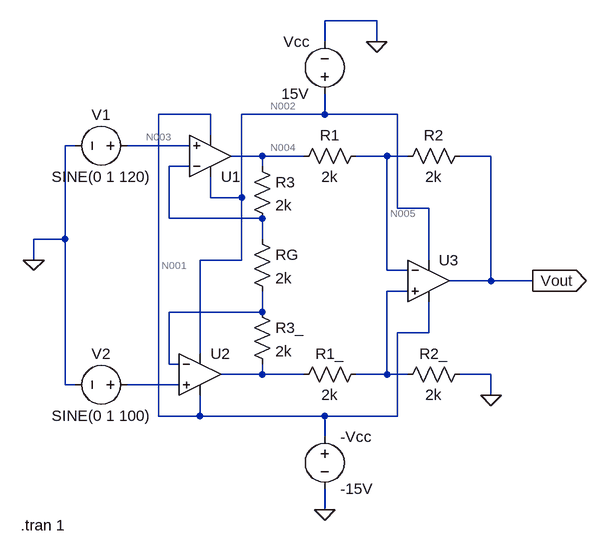
[diagram p0: schematic Q4.asc]
Q4.asc, the LTspice schematic file:
Version 4
SHEET 1 880 680
WIRE 320 -272 240 -272
WIRE 240 -240 240 -272
WIRE 320 -240 320 -272
WIRE 64 -128 -16 -128
WIRE 240 -128 240 -160
WIRE 240 -128 112 -128
WIRE 352 -128 240 -128
WIRE 64 -96 64 -128
WIRE -144 -80 -160 -80
WIRE 32 -80 -64 -80
WIRE 144 -64 96 -64
WIRE 208 -64 144 -64
WIRE 336 -64 288 -64
WIRE 368 -64 336 -64
WIRE 496 -64 448 -64
WIRE 32 -48 0 -48
WIRE 144 -48 144 -64
WIRE 64 0 64 -32
WIRE 112 0 112 -128
WIRE 112 0 64 0
WIRE 352 16 352 -128
WIRE 400 16 352 16
WIRE 0 32 0 -48
WIRE 144 32 0 32
WIRE -160 64 -160 -80
WIRE -160 64 -208 64
WIRE 144 64 144 32
WIRE -208 96 -208 64
WIRE 112 96 112 0
WIRE 112 96 48 96
WIRE 400 96 400 16
WIRE 336 112 336 -64
WIRE 368 112 336 112
WIRE 496 128 496 -64
WIRE 496 128 432 128
WIRE 560 128 496 128
WIRE 368 144 336 144
WIRE 144 176 144 144
WIRE 144 176 0 176
WIRE 400 208 400 160
WIRE 400 208 352 208
WIRE 48 240 48 96
WIRE 0 256 0 176
WIRE 16 256 0 256
WIRE 144 272 144 256
WIRE 144 272 80 272
WIRE 208 272 144 272
WIRE 336 272 336 144
WIRE 336 272 288 272
WIRE 368 272 336 272
WIRE 496 272 448 272
WIRE -160 288 -160 64
WIRE -144 288 -160 288
WIRE 16 288 -64 288
WIRE 496 304 496 272
WIRE -16 336 -16 -128
WIRE 48 336 48 304
WIRE 48 336 -16 336
WIRE 240 336 48 336
WIRE 352 336 352 208
WIRE 352 336 240 336
WIRE 240 368 240 336
WIRE 240 480 240 448
FLAG 496 304 0
FLAG 560 128 Vout
IOPIN 560 128 Out
FLAG 320 -240 0
FLAG 240 480 0
FLAG -208 96 0
SYMBOL Opamps\\UniversalOpamp2 48 272 R0
SYMATTR InstName U2
SYMBOL Opamps\\UniversalOpamp2 400 128 R0
SYMATTR InstName U3
SYMBOL Opamps\\UniversalOpamp2 64 -64 M180
SYMATTR InstName U1
SYMBOL res 128 -64 R0
SYMATTR InstName R3
SYMATTR Value 2k
SYMBOL res 128 160 R0
SYMATTR InstName R3_
SYMATTR Value 2k
SYMBOL res 128 48 R0
SYMATTR InstName RG
SYMATTR Value 2k
SYMBOL res 304 -80 R90
WINDOW 0 0 56 VBottom 2
WINDOW 3 32 56 VTop 2
SYMATTR InstName R1
SYMATTR Value 2k
SYMBOL res 304 256 R90
WINDOW 0 0 56 VBottom 2
WINDOW 3 32 56 VTop 2
SYMATTR InstName R1_
SYMATTR Value 2k
SYMBOL res 464 -80 R90
WINDOW 0 0 56 VBottom 2
WINDOW 3 32 56 VTop 2
SYMATTR InstName R2
SYMATTR Value 2k
SYMBOL res 464 256 R90
WINDOW 0 0 56 VBottom 2
WINDOW 3 32 56 VTop 2
SYMATTR InstName R2_
SYMATTR Value 2k
SYMBOL voltage 240 352 R0
SYMATTR InstName -Vcc
SYMATTR Value -15V
SYMBOL voltage 240 -144 R180
WINDOW 0 24 96 Left 2
WINDOW 3 24 16 Left 2
SYMATTR InstName Vcc
SYMATTR Value 15V
SYMBOL voltage -48 -80 R90
WINDOW 0 -32 56 VBottom 2
WINDOW 3 32 56 VTop 2
WINDOW 123 0 0 Left 0
WINDOW 39 0 0 Left 0
SYMATTR InstName V1
SYMATTR Value SINE(0 1 120)
SYMBOL voltage -48 288 R90
WINDOW 0 -32 56 VBottom 2
WINDOW 3 32 56 VTop 2
WINDOW 123 0 0 Left 0
WINDOW 39 0 0 Left 0
SYMATTR InstName V2
SYMATTR Value SINE(0 1 100)
TEXT -228 504 Left 2 !.tran 1

The netlist it stands for:
* Q4.asc
XU2 N010 N008 N002 N001 N009 level.2 Avol=1Meg GBW=10Meg Slew=10Meg ilimit=25m rail=0 Vos=0 phimargin=45 en=0 enk=0 in=0 ink=0 Rin=500Meg  ; pins IN+ IN- V+ V- OUT
XU3 N007 N005 N002 N001 Vout level.2 Avol=1Meg GBW=10Meg Slew=10Meg ilimit=25m rail=0 Vos=0 phimargin=45 en=0 enk=0 in=0 ink=0 Rin=500Meg  ; pins IN+ IN- V+ V- OUT
XU1 N003 N006 N002 N001 N004 level.2 Avol=1Meg GBW=10Meg Slew=10Meg ilimit=25m rail=0 Vos=0 phimargin=45 en=0 enk=0 in=0 ink=0 Rin=500Meg  ; pins IN+ IN- V+ V- OUT
R3 N004 N006 2k
R3_ N008 N009 2k
RG N006 N008 2k
R1 N005 N004 2k
R1_ N007 N009 2k
R2 Vout N005 2k
R2_ 0 N007 2k
V§-Vcc N001 0 -15V
Vcc N002 0 15V
V1 N003 0 SINE(0 1 120)
V2 N010 0 SINE(0 1 100)
.tran 1
.lib UniversalOpamps2.sub
.backanno
.end

* Results of the author's LTspice run, read from the files saved beside the schematic
* Operating Point, zero values left out:
*   V(n002) = 15 V
*   V(n001) = -15 V
*   I(Vcc) = -4.495 mA
*   I(-vcc) = 4.495 mA
*   Ix(u2:3) = 1.498 mA
*   Ix(u2:4) = -1.498 mA
*   Ix(u3:3) = 1.498 mA
*   Ix(u3:4) = -1.498 mA
*   Ix(u1:3) = 1.498 mA
*   Ix(u1:4) = -1.498 mA
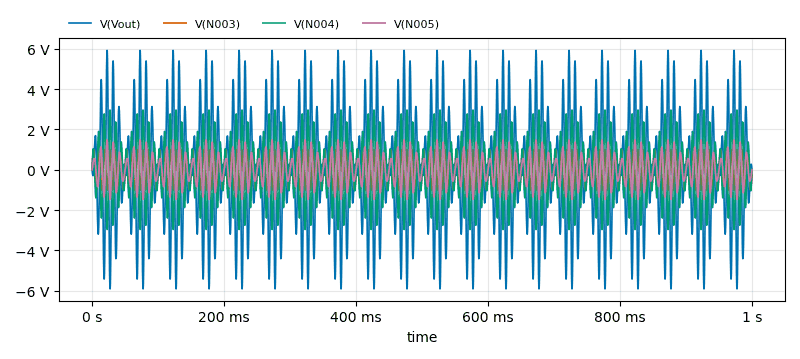
[diagram p1: Transient Analysis of Q4.asc, plotted from the saved traces]
* Transient Analysis, 1 run:
*   V(Vout): min -5.904 V, max 5.919 V, average -849.8 µV, rms 2.983 V, last 19.45 µV
*   V(N003): min -999.9 mV, max 999.7 mV, average 140.8 µV, rms 713.4 mV, last 0 V
*   V(N004): min -2.965 V, max 2.961 V, average 490 µV, rms 1.573 V, last -13.06 µV
*   V(N005): min -1.48 V, max 1.48 V, average -179.9 µV, rms 785.8 mV, last 3.191 µV